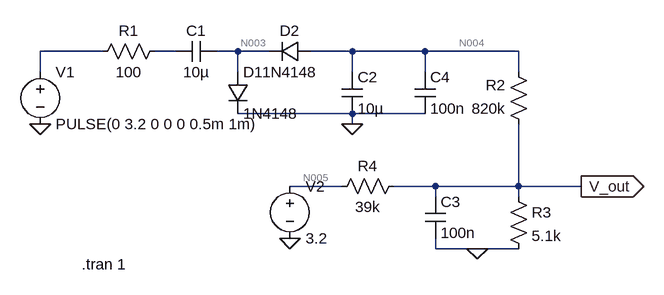
[diagram p0: schematic Sim_Offset_negativo.asc]
Sim_Offset_negativo.asc, the LTspice schematic file:
Version 4
SHEET 1 880 680
WIRE -96 48 -192 48
WIRE 16 48 -16 48
WIRE 112 48 80 48
WIRE 160 48 112 48
WIRE 288 48 224 48
WIRE 400 48 288 48
WIRE 544 48 400 48
WIRE -192 80 -192 48
WIRE 112 80 112 48
WIRE 288 80 288 48
WIRE 400 80 400 48
WIRE 544 80 544 48
WIRE 288 144 112 144
WIRE 400 144 288 144
WIRE 288 160 288 144
WIRE 272 256 192 256
WIRE 416 256 352 256
WIRE 544 256 544 160
WIRE 544 256 416 256
WIRE 640 256 544 256
WIRE 416 272 416 256
WIRE 544 272 544 256
WIRE 416 352 416 336
WIRE 480 352 416 352
WIRE 544 352 480 352
FLAG 192 336 0
FLAG -192 160 0
FLAG 288 160 0
FLAG 480 352 0
FLAG 640 256 V_out
IOPIN 640 256 Out
SYMBOL voltage -192 64 R0
WINDOW 123 0 0 Left 0
WINDOW 39 0 0 Left 0
SYMATTR InstName V1
SYMATTR Value PULSE(0 3.2 0 0 0 0.5m 1m)
SYMBOL voltage 192 240 R0
WINDOW 123 0 0 Left 0
WINDOW 39 0 0 Left 0
SYMATTR InstName V2
SYMATTR Value 3.2
SYMBOL res 0 32 R90
WINDOW 0 0 56 VBottom 2
WINDOW 3 32 56 VTop 2
SYMATTR InstName R1
SYMATTR Value 100
SYMBOL res 560 176 R180
WINDOW 0 36 76 Left 2
WINDOW 3 36 40 Left 2
SYMATTR InstName R2
SYMATTR Value 820k
SYMBOL cap 80 32 R90
WINDOW 0 0 32 VBottom 2
WINDOW 3 32 32 VTop 2
SYMATTR InstName C1
SYMATTR Value 10µ
SYMBOL diode 96 80 R0
SYMATTR InstName D1
SYMATTR Value 1N4148
SYMBOL diode 224 32 R90
WINDOW 0 0 32 VBottom 2
WINDOW 3 32 32 VTop 2
SYMATTR InstName D2
SYMATTR Value 1N4148
SYMBOL cap 272 80 R0
SYMATTR InstName C2
SYMATTR Value 10µ
SYMBOL res 528 256 R0
SYMATTR InstName R3
SYMATTR Value 5.1k
SYMBOL res 368 240 R90
WINDOW 0 0 56 VBottom 2
WINDOW 3 32 56 VTop 2
SYMATTR InstName R4
SYMATTR Value 39k
SYMBOL cap 400 272 R0
SYMATTR InstName C3
SYMATTR Value 100n
SYMBOL cap 384 80 R0
SYMATTR InstName C4
SYMATTR Value 100n
TEXT -128 376 Left 2 !.tran 1

The netlist it stands for:
* Sim_Offset_negativo.asc
V1 N001 0 PULSE(0 3.2 0 0 0 0.5m 1m)
V2 N005 0 3.2
R1 N002 N001 100
R2 V_out N004 820k
C1 N003 N002 10µ
D1 N003 0 1N4148
D2 N004 N003 1N4148
C2 N004 0 10µ
R3 V_out 0 5.1k
R4 V_out N005 39k
C3 V_out 0 100n
C4 N004 0 100n
.model D D
.lib standard.dio
.tran 1
.backanno
.end

* Results of the author's LTspice run, read from the files saved beside the schematic
* Operating Point, zero values left out:
*   V(n005) = 3.2 V
*   V(v_out) = 369.7 mV
*   V(n004) = 309.2 mV
*   V(n003) = 154.6 mV
*   I(D2) = 73.85 nA
*   I(D1) = 73.85 nA
*   I(R4) = -72.57 µA
*   I(R3) = 72.5 µA
*   I(R2) = 73.85 nA
*   I(V2) = -72.57 µA